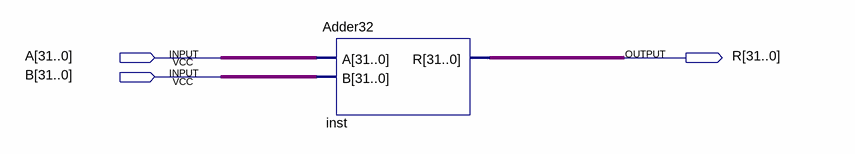
[diagram p0: schematic sheet]
// Quartus schematic TesteAdder32.bdf as structural Verilog: 1 symbols, 3 pins
module TesteAdder32 (
  input  [31:0] A,
  input  [31:0] B,
  output [31:0] R
);

  Adder32 inst (.A(A), .B(B), .R(R));
endmodule
